# EAGLE schematic temp (EAGLE 6.4)
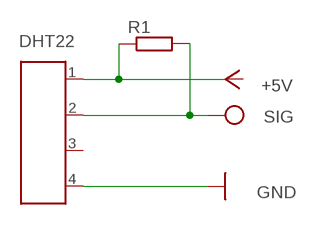
[diagram p0: schematic, sheet 1]

## Parts
DHT22  MESSFUEHLER_4  [MESSFUEHLER_4]
R1  R-EU_0204/2V  [0204V]

## Nets
GND: DHT22.4
N$1: DHT22.1 R1.1
VSS: DHT22.2 R1.2 ; supply symbol labelled SIG
Unconnected: DHT22.3

## Library data of the parts
DHT22 = e-messfuehler:MESSFUEHLER_4: Messfühler mit vier Anschlüssen, 2 Versorgung, 2 Signal; OC_NEWARK: unknown
R1 = resistor:R-EU_: RESISTOR, European symbol; OC_NEWARK: unknown